# Altium schematic sheet MCU.SchDoc
size A4; SheetNumber: 4; SheetTotal: 4
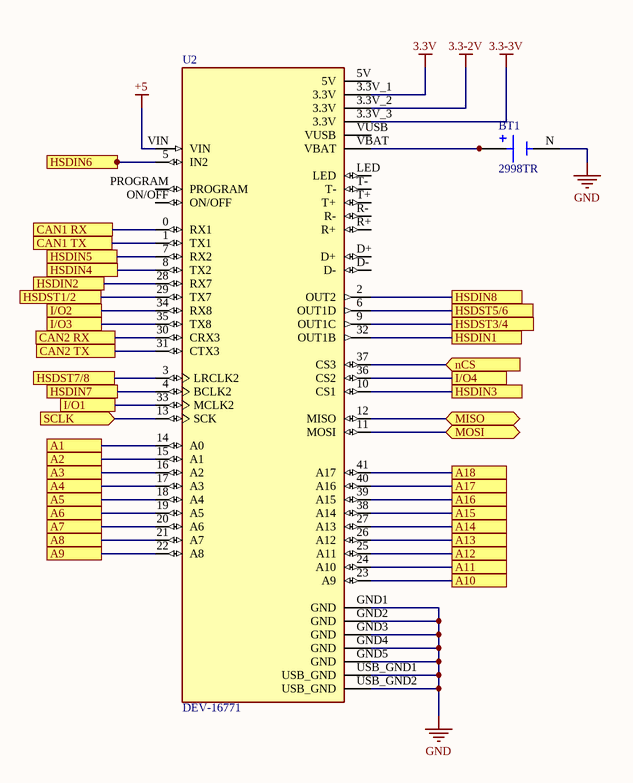
[diagram p0: MCU.SchDoc]

## Parts
BT1  2998TR  [BAT_2998TR]
U2  DEV-16771  [MODULE_DEV-16771]

## Ports
A1, A2, A3, A4, A5, A6, A7, A8, A9, A10, A11, A12, A13, A14, A15, A16, A17, A18, CAN1 RX, CAN1 TX, CAN2 RX, CAN2 TX, HSDIN1, HSDIN2, HSDIN3, HSDIN4, HSDIN5, HSDIN6, HSDIN7, HSDIN8, HSDST1/2, HSDST3/4, HSDST5/6, HSDST7/8, I/O1, I/O2, I/O3, I/O4, MISO (bidir), MOSI (bidir), nCS (in), SCLK (in)

## Nets
3.3-2V: U2.3.3V_2(3.3V)
3.3-3V: U2.3.3V_3(3.3V)
3.3V: U2.3.3V_1(3.3V)
+5: U2.VIN
GND: BT1.N(NEG) U2.GND1(GND) U2.GND2(GND) U2.GND3(GND) U2.GND4(GND) U2.GND5(GND) U2.USB_GND1(USB_GND) U2.USB_GND2(USB_GND)
A1: U2.14(A0) ; port A1
A2: U2.15(A1) ; port A2
A3: U2.16(A2) ; port A3
A4: U2.17(A3) ; port A4
A5: U2.18(A4) ; port A5
A6: U2.19(A5) ; port A6
A7: U2.20(A6) ; port A7
A8: U2.21(A7) ; port A8
A9: U2.22(A8) ; port A9
A10: U2.23(A9) ; port A10
A11: U2.24(A10) ; port A11
A12: U2.25(A11) ; port A12
A13: U2.26(A12) ; port A13
A14: U2.27(A13) ; port A14
A15: U2.38(A14) ; port A15
A16: U2.39(A15) ; port A16
A17: U2.40(A16) ; port A17
A18: U2.41(A17) ; port A18
CAN1 RX: U2.0(RX1) ; port CAN1 RX
CAN1 TX: U2.1(TX1) ; port CAN1 TX
CAN2 RX: U2.30(CRX3) ; port CAN2 RX
CAN2 TX: U2.31(CTX3) ; port CAN2 TX
HSDIN1: U2.32(OUT1B) ; port HSDIN1
HSDIN2: U2.28(RX7) ; port HSDIN2
HSDIN3: U2.10(CS1) ; port HSDIN3
HSDIN4: U2.8(TX2) ; port HSDIN4
HSDIN5: U2.7(RX2) ; port HSDIN5
HSDIN6: U2.5(IN2) ; port HSDIN6
HSDIN7: U2.4(BCLK2) ; port HSDIN7
HSDIN8: U2.2(OUT2) ; port HSDIN8
HSDST1/2: U2.29(TX7) ; port HSDST1/2
HSDST3/4: U2.9(OUT1C) ; port HSDST3/4
HSDST5/6: U2.6(OUT1D) ; port HSDST5/6
HSDST7/8: U2.3(LRCLK2) ; port HSDST7/8
I/O1: U2.33(MCLK2) ; port I/O1
I/O2: U2.34(RX8) ; port I/O2
I/O3: U2.35(TX8) ; port I/O3
I/O4: U2.36(CS2) ; port I/O4
MISO: U2.12(MISO) ; port MISO
MOSI: U2.11(MOSI) ; port MOSI
nCS: U2.37(CS3) ; port nCS
SCLK: U2.13(SCK) ; port SCLK
NetBT1_P1: BT1.P1(POS) BT1.P2(POS) U2.VBAT

Not connected (* = marked no-connect by the designer): U2 5V D+ D- LED ON/OFF PROGRAM R+ R- T+ T- VUSB

## Library data of the parts
BT1 = CMP-240-000000-1: Availability: Unavailable; Component Type: Standard; MP: 2998TR; Value: *; Pin Count: 3; Design Item ID: 2998TR; Source: 2998TR.SchLib; Price: None; Package: None
U2 = CMP-160-000000-1: RT1062 Teensy 4.1 series ARMÂ® CortexÂ®-M7 MPU Embedded Evaluation Board; MF: SparkFun Electronics; Source: DEV-16771.SchLib; Pin Count: 65; Purchase-URL: https://pricing.snapeda.com/search/part/DEV-16771/?ref=eda; SnapEDA_Link: https://www.snapeda.com/parts/DEV-16771/SparkFun+Electronics/view-part/?ref=snap; Design Item ID: DEV-16771; Package: None; Check_prices: https://www.snapeda.com/parts/DEV-16771/SparkFun+Electronics/view-part/?ref=eda; Availability: In Stock; Component Type: Standard; MP: DEV-16771; Price: None; Value: *